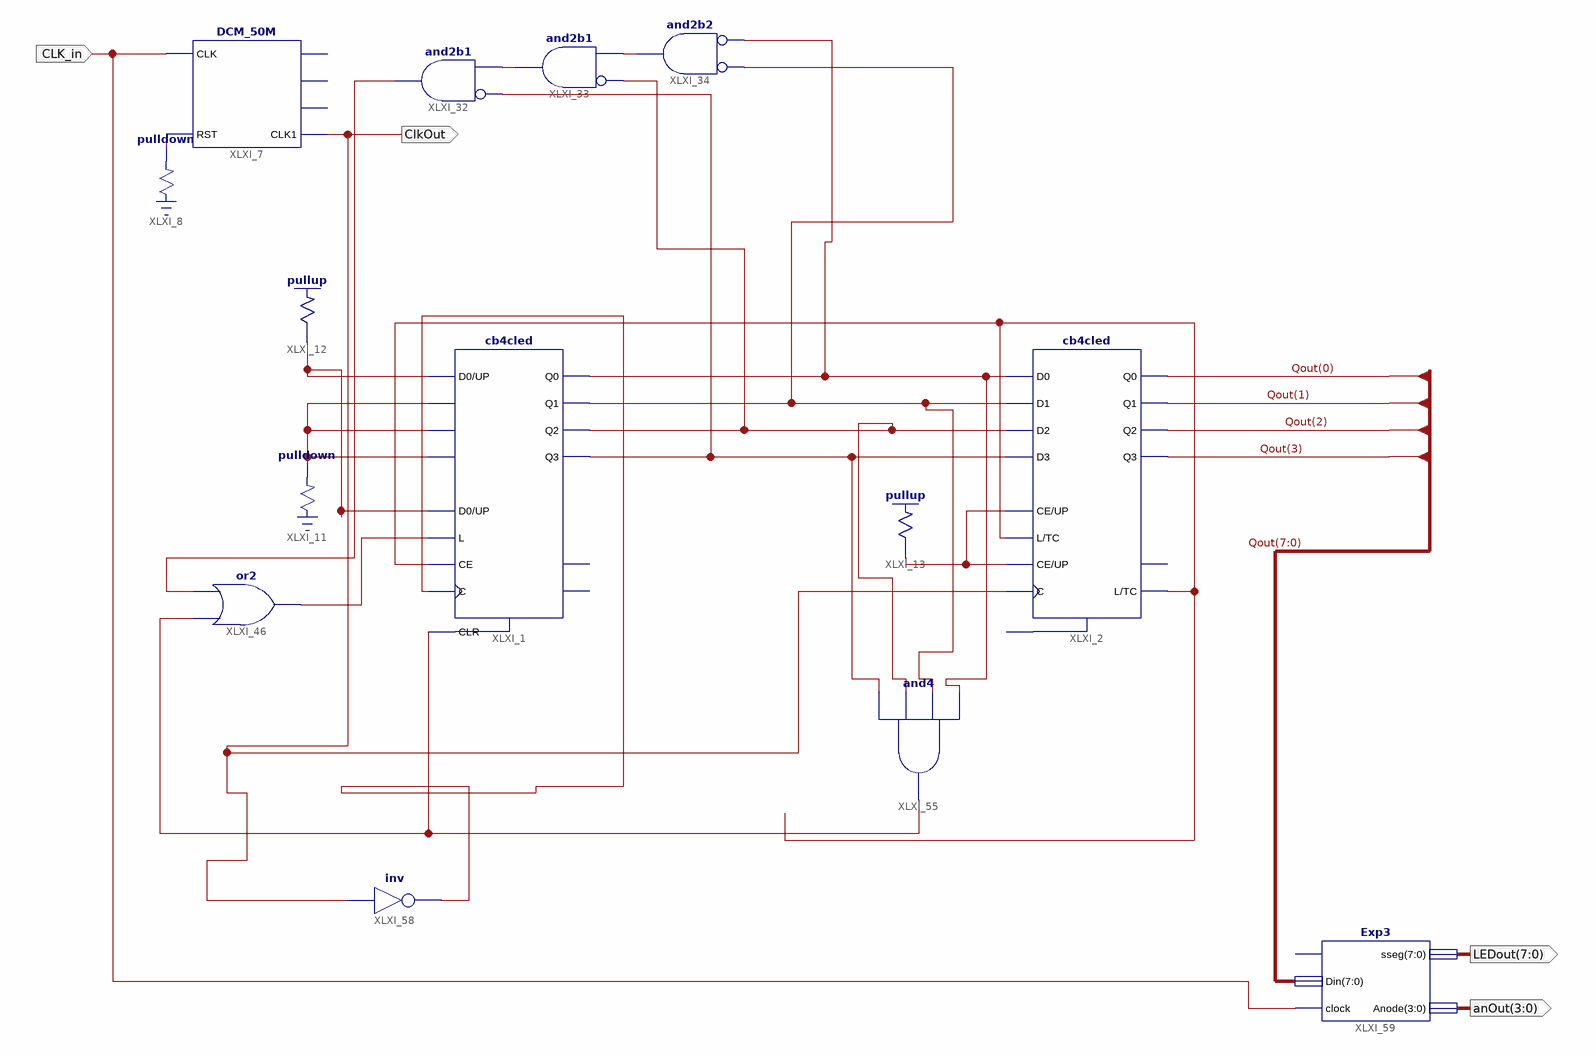
[diagram p0: schematic sheet 1]
// Xilinx ISE schematic Lab8Exp8.sch (spartan3e) as structural Verilog: 14 symbols, 4 ports
module Lab8Exp8 (
  input  CLK_in,
  output [7:0] LEDout,
  output [3:0] anOut,
  output ClkOut
);

  wire XLXN_13, XLXN_19, XLXN_20, XLXN_24, XLXN_33, XLXN_34, XLXN_35, XLXN_49, XLXN_55, XLXN_67, XLXN_69,
       XLXN_71, XLXN_82, XLXN_83, XLXN_85;
  wire [7:0] Qout;

  cb4cled XLXI_1 (
    .C(XLXN_49), .CE(XLXN_67), .CLR(XLXN_85), .D0(XLXN_20), .D1(XLXN_19), .D2(XLXN_19), .D3(XLXN_19),
    .L(XLXN_71), .UP(XLXN_20), .Q0(XLXN_35), .Q1(XLXN_83), .Q2(XLXN_82), .Q3(XLXN_55));  // open: CEO, TC
  cb4cled XLXI_2 (
    .C(ClkOut), .CE(XLXN_24), .D0(XLXN_35), .D1(XLXN_83), .D2(XLXN_82), .D3(XLXN_55), .L(XLXN_67),
    .UP(XLXN_24), .Q0(Qout[0]), .Q1(Qout[1]), .Q2(Qout[2]), .Q3(Qout[3]), .TC(XLXN_67));  // open: CLR, CEO
  DCM_50M XLXI_7 (.CLK(CLK_in), .RST(XLXN_13), .CLK1(ClkOut));  // open: CLK1M, CLK10k, CLK1k
  \pulldown  XLXI_8 (.O(XLXN_13));
  \pulldown  XLXI_11 (.O(XLXN_19));
  \pullup  XLXI_12 (.O(XLXN_20));
  \pullup  XLXI_13 (.O(XLXN_24));
  and XLXI_32 (XLXN_69, ~XLXN_55, XLXN_33);  // and2b1
  and XLXI_33 (XLXN_33, ~XLXN_82, XLXN_34);  // and2b1
  and XLXI_34 (XLXN_34, ~XLXN_83, ~XLXN_35);  // and2b2
  or XLXI_46 (XLXN_71, XLXN_85, XLXN_69);
  and XLXI_55 (XLXN_85, XLXN_55, XLXN_82, XLXN_83, XLXN_35);
  not XLXI_58 (XLXN_49, ClkOut);
  Exp3 XLXI_59 (.Din(Qout), .clock(CLK_in), .sseg(LEDout), .Anode(anOut));  // open: ButtonEn
endmodule
